# Altium schematic sheet MCU.SchDoc: Microcontroller circuit
size A; DrawnBy: Nidula Gunawardana; SheetNumber: 2; SheetTotal: 4
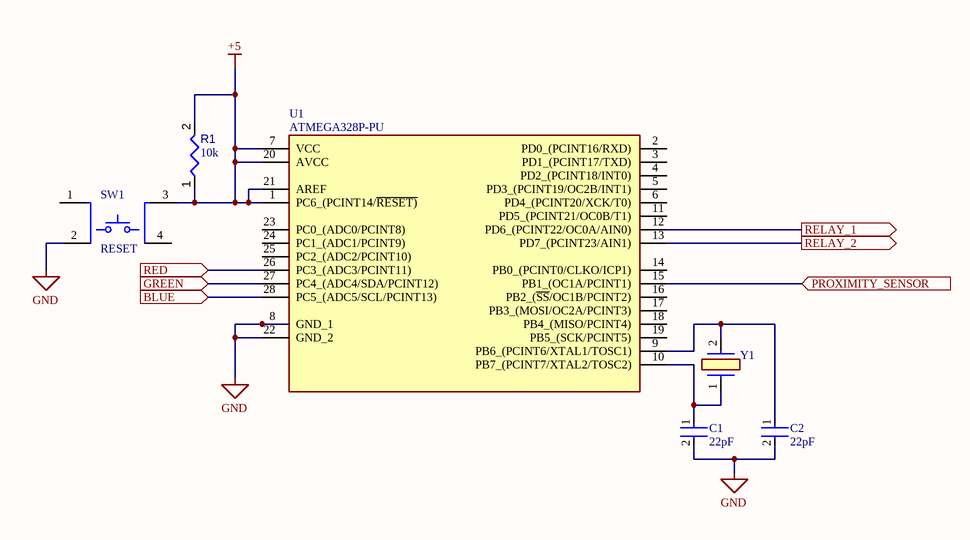
[diagram p0: MCU.SchDoc]

## Parts
C1  22pF  [FP-RCE0DB-MFG]
C2  22pF  [FP-RCE0DB-MFG]
R1  value 10k  [RESA60-630X240]  (hidden comment: MFR-25FBF52-10K)
SW1  RESET  [FP-SKQBARA010-MFG]
U1  ATMEGA328P-PU  [DIP794W53P254L3467H457Q28N]
Y1  ECS-160-S-4X  [ECS160S4X]  (value not drawn)

## Ports
BLUE (in), GREEN (in), PROXIMITY_SENSOR (in), RED (in), RELAY_1 (out), RELAY_2 (out)

## Nets
+5: R1.1 R1.2 SW1.3 U1.1(PC6_(PCINT14/~{RESET)}) U1.7(VCC) U1.20(AVCC) U1.21(AREF)
GND: C1.2 C2.2 SW1.2 U1.8(GND_1) U1.22(GND_2)
BLUE: U1.28(PC5_(ADC5/SCL/PCINT13)) ; port BLUE
GREEN: U1.27(PC4_(ADC4/SDA/PCINT12)) ; port GREEN
PROXIMITY_SENSOR: U1.15(PB1_(OC1A/PCINT1)) ; port PROXIMITY_SENSOR
RED: U1.26(PC3_(ADC3/PCINT11)) ; port RED
RELAY_1: U1.12(PD6_(PCINT22/OC0A/AIN0)) ; port RELAY_1
RELAY_2: U1.13(PD7_(PCINT23/AIN1)) ; port RELAY_2
NetC1_1: C1.1 U1.10(PB7_(PCINT7/XTAL2/TOSC2)) Y1.1
NetC2_1: C2.1 U1.9(PB6_(PCINT6/XTAL1/TOSC1)) Y1.2

Not connected (* = marked no-connect by the designer): SW1 1 4; U1 2(PD0_(PCINT16/RXD)) 3(PD1_(PCINT17/TXD)) 4(PD2_(PCINT18/INT0)) 5(PD3_(PCINT19/OC2B/INT1)) 6(PD4_(PCINT20/XCK/T0)) 11(PD5_(PCINT21/OC0B/T1)) 14(PB0_(PCINT0/CLKO/ICP1)) 16(PB2_(~{SS}/OC1B/PCINT2)) 17(PB3_(MOSI/OC2A/PCINT3)) 18(PB4_(MISO/PCINT4)) 19(PB5_(SCK/PCINT5)) 23(PC0_(ADC0/PCINT8)) 24(PC1_(ADC1/PCINT9)) 25(PC2_(ADC2/PCINT10))

## Library data of the parts
C1 C2 = CMP-06035-047347-1: Cap Ceramic 22pF 100V C0G ±5% Radial 2.5mm +125°C Ammo Pack; Lead Diameter: 0.5mm; Lead/Base Style: Straight; Height: 3.5mm; Voltage: 100V; Mount: Through Hole; Min Operating Temperature: -55°C; Height - Seated (Max): 0.138inch; Dielectric: C0G; Width: 0.098inch; Depth: 2.5mm; Lead Pitch: 0.098inch; Packaging: Tape and Reel; Voltage Rating (DC): 100V; Capacitance: 22pF; Package Quantity: 2000; Max Operating Temperature: 125°C; Tolerance: 5%; Termination: Radial; Voltage Rating: 100V; Case/Package: Radial; Resistor Type: Ceramic; Length: 3.6mm; Ratings: AEC-Q200
R1 = CMP-009-00047-4: Axial Resistor, 10 KOhm, +/- 1%, 0.25 W, -55 to 155 degC, 2-Pin THD, RoHS, Bulk; Manufacturer: Yageo; Power: 250mW; Voltage Rating: 250V; Manufacturer URL: http://www.yageo.com/; Datasheet URL: http://www.yageo.com/documents/recent/Yageo%20LR_MFR_2013.pdf; Package Reference: MFR-25; Min Operating Temperature: -55°C; Mounting Technology: TH; Package Quantity: 200; Case/Package: Axial; Tolerance: 1%; RoHS Compliant: True; Datasheet Version: Apr-13; Packaging: Bulk; Max Operating Temperature: 155°C; Package Description: 2-Pin Axial Lead, Dia 2.4 mm, Body Length 6.3 mm
SW1 = CMP-00631-07849992-1: SKQBARA010 Switch Tactile N.O. SPST Round Button PC Pins 0.05A 12VDC 1.57N Thru-Hole Automotive; Life (Cycles): 100kcycles; Max Voltage Rating (DC): 12V; Contact Current Rating: 50mA; Contact Resistance: 500mΩ; Actuator Length: 850µm; Number of Positions: 2; Max Operating Temperature: 90°C; Throw Configuration: SPST; Contact Plating: Silver; Electrical Life: 100kcycles; RoHS: Compliant; Height: 5mm; Voltage Rating (DC): 12V; Termination: PC Pins; Orientation: Straight; Depth: 10.3mm; NexarPartId: 7849992; Packaging: Bulk; Color: Grey; Operating Force: 1.57N; Radiation Hardening: No; Schedule B: 8536509065, 8536509065; Current Rating: 50mA; Lead Free: Lead Free; Length: 10mm; Mount: Through Hole; Max Current Rating: 50mA; Min Operating Temperature: -40°C
U1 = ATMEGA328P-PU: Integrated Circuit; Manufacturer_Name: Microchip; Datasheet Link: https://www.mouser.ca/datasheet/2/268/ATmega48A_PA_88A_PA_168A_PA_328_P_DS_DS40002061B-3050139.pdf; Height: 4.572mm; Manufacturer_Part_Number: ATMEGA328P-PU; Mouser Part Number: 556-ATMEGA328P-PU; Mouser Price/Stock: https://www.mouser.co.uk/ProductDetail/Microchip-Technology/ATMEGA328P-PU?qs=K8BHR703ZXguOQv3sKbWcg%3D%3D; Arrow Part Number: ATMEGA328P-PU; Arrow Price/Stock: https://www.arrow.com/en/products/atmega328p-pu/microchip-technology?region=europe
Y1 = ECS-160-S-4X: Crystal or Oscillator; Manufacturer_Name: ECS; Datasheet Link: http://www.ecsxtal.com/store/pdf/hc-49usx.pdf; Height: 3.5mm; Manufacturer_Part_Number: ECS-160-S-4X; Mouser Part Number: 520-HCU1600-SX; Mouser Price/Stock: https://www.mouser.co.uk/ProductDetail/ECS/ECS-160-S-4X?qs=CNVyLAqdhH109We7RtSowA%3D%3D; Arrow Part Number: ECS-160-S-4X; Arrow Price/Stock: https://www.arrow.com/en/products/ecs-160-s-4x/ecs-international?region=nac